# EAGLE design feu_85 (EAGLE 6.3)
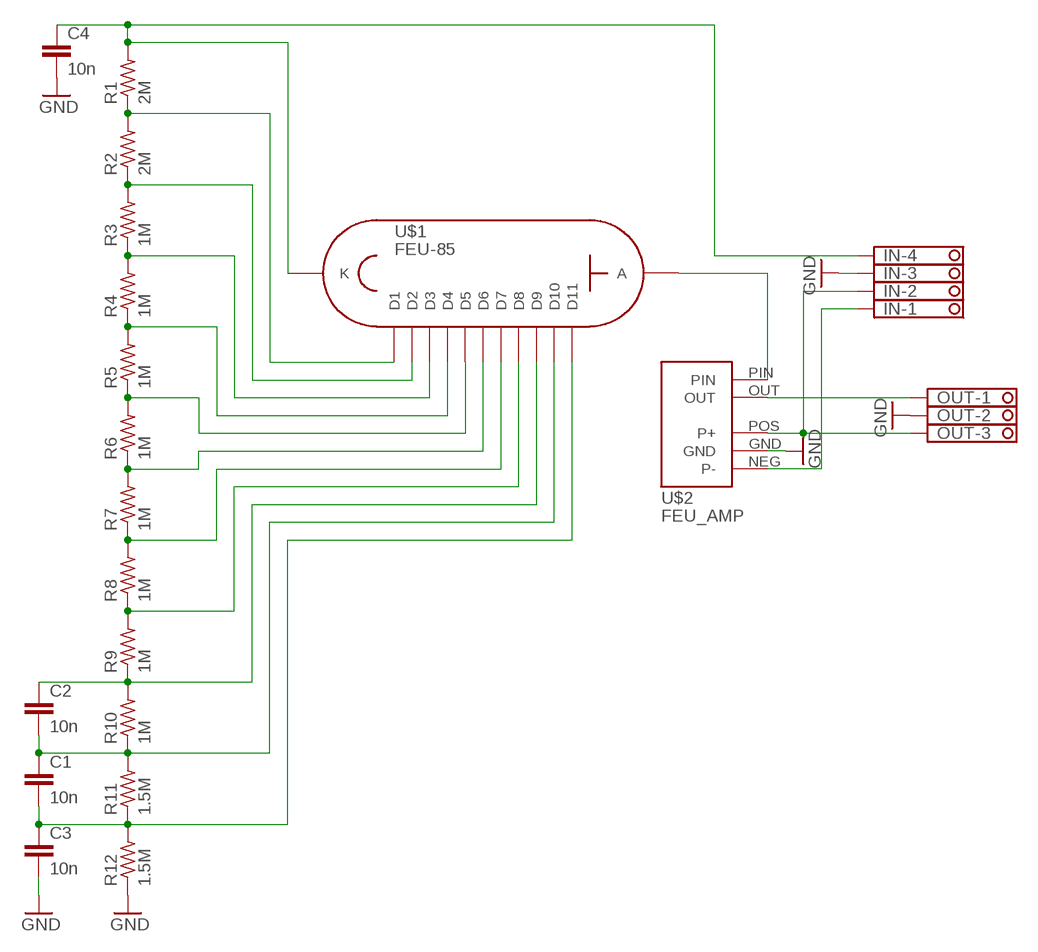
[diagram p0: schematic, sheet 1]

## Parts
C1  10n  C-EU075-032X103  [C075-032X103]
C2  10n  C-EU075-032X103  [C075-032X103]
C3  10n  C-EU075-032X103  [C075-032X103]
C4  10n  C-EU225-087X268  [C225-087X268]
IN  1751264  [1751264]
OUT  1751251  [1751251]
R1  2M  R-US_0207/2V  [0207/2V]
R2  2M  R-US_0207/2V  [0207/2V]
R3  1M  R-US_0207/2V  [0207/2V]
R4  1M  R-US_0207/2V  [0207/2V]
R5  1M  R-US_0207/2V  [0207/2V]
R6  1M  R-US_0207/2V  [0207/2V]
R7  1M  R-US_0207/2V  [0207/2V]
R8  1M  R-US_0207/2V  [0207/2V]
R9  1M  R-US_0207/2V  [0207/2V]
R10  1M  R-US_0207/2V  [0207/2V]
R11  1.5M  R-US_0207/2V  [0207/2V]
R12  1.5M  R-US_0207/2V  [0207/2V]
U$1  FEU-85  [PANEL_14]
U$2  FEU_AMP  [FEU_AMP]

## Nets
GND: C3.2 C4.2 IN.3 OUT.2 R12.1 U$2.GND
N$1: R1.1 R2.2 U$1.P$13(D1)
N$2: R3.1 R4.2 U$1.P$12(D3)
N$3: R4.1 R5.2 U$1.P$3(D4)
N$4: R5.1 R6.2 U$1.P$11(D5)
N$5: R6.1 R7.2 U$1.P$4(D6)
N$6: R7.1 R8.2 U$1.P$10(D7)
N$7: R8.1 R9.2 U$1.P$5(D8)
N$8: C2.1 R9.1 R10.2 U$1.P$9(D9)
N$9: OUT.1 U$2.OUT
N$10: IN.2 OUT.3 U$2.POS(P+)
N$11: R2.1 R3.2 U$1.P$2(D2)
N$12: C4.1 IN.4 R1.2 U$1.P$14(K)
N$13: C1.2 C3.1 R11.1 R12.2 U$1.P$8(D11)
N$14: C1.1 C2.2 R10.1 R11.2 U$1.P$6(D10)
N$15: U$1.P$7(A) U$2.PIN
N$16: IN.1 U$2.NEG(P-)

## Library data of the parts
C1-C4 = resistor:C-EU: CAPACITOR, European symbol
IN = con-phoenix-350:1751264: MKDS 1/ 4-3,5 Printklemme Nennstrom: 10 A Bemessungsspannung: 160 V Raster: 3,5 mm Polzahl: 4 Montageart: Löten Anschlussart: Schraubanschluss Anschlussrichtung vom Leiter zur Platine: 0° Source: http://eshop.phoenixcontact.com .. 1751264.pdf; MPN: 1751264; OC_FARNELL: unknown; OC_NEWARK: 10R0934
OUT = con-phoenix-350:1751251: MKDS 1/ 3-3,5 Printklemme Nennstrom: 10 A Bemessungsspannung: 160 V Raster: 3,5 mm Polzahl: 3 Montageart: Löten Anschlussart: Schraubanschluss Anschlussrichtung vom Leiter zur Platine: 0° Source: http://eshop.phoenixcontact.com .. 1751251.pdf; OC_FARNELL: unknown; OC_NEWARK: unknown
R1-R12 = resistor:R-US_: RESISTOR, American symbol
U$1 = pmt:FEU-85: FEU-85
U$2 = pwr:FEU_AMP: FEU amplifier

## Board
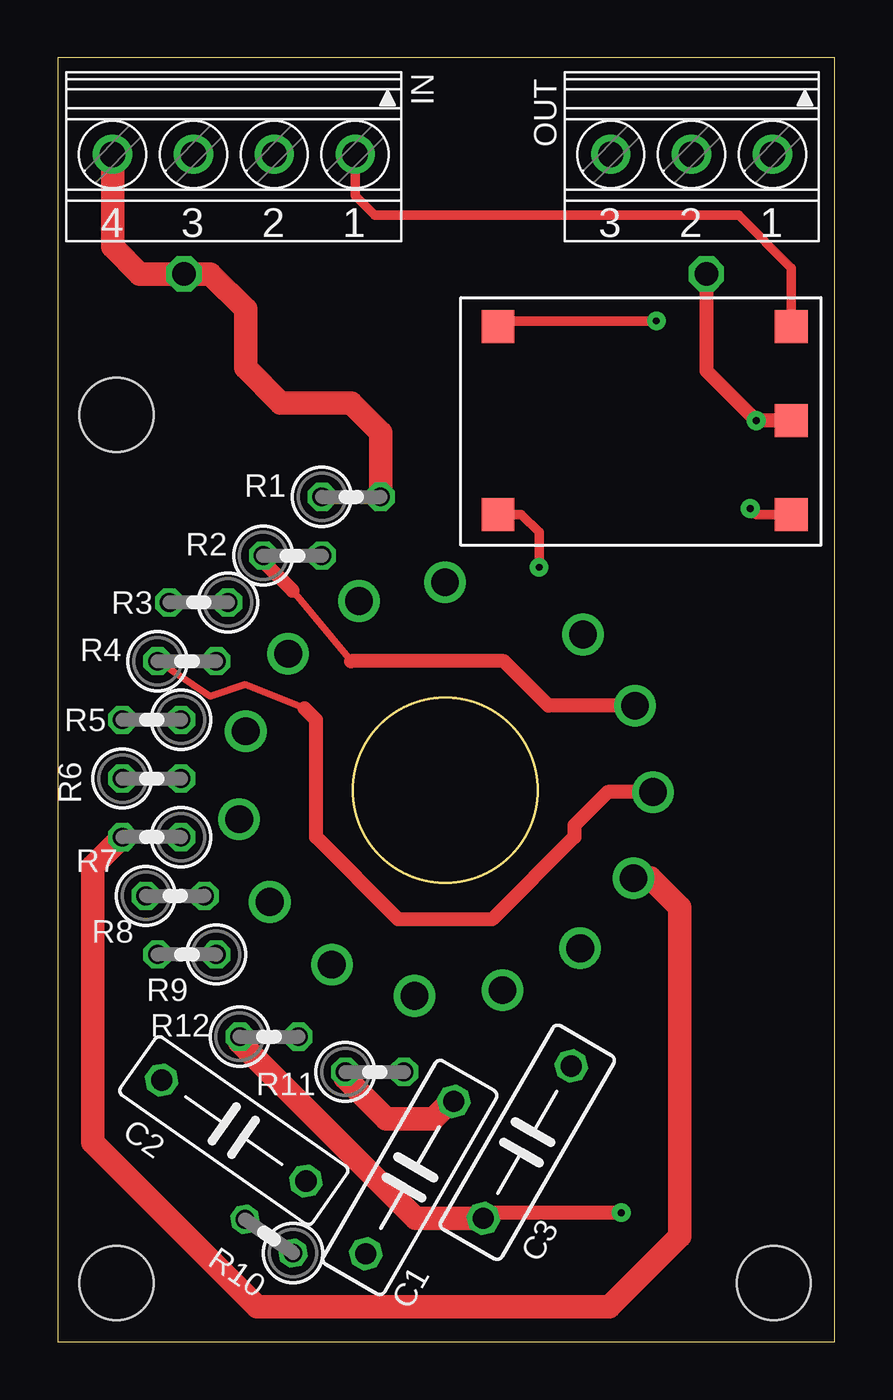
[diagram p1: board, top side]
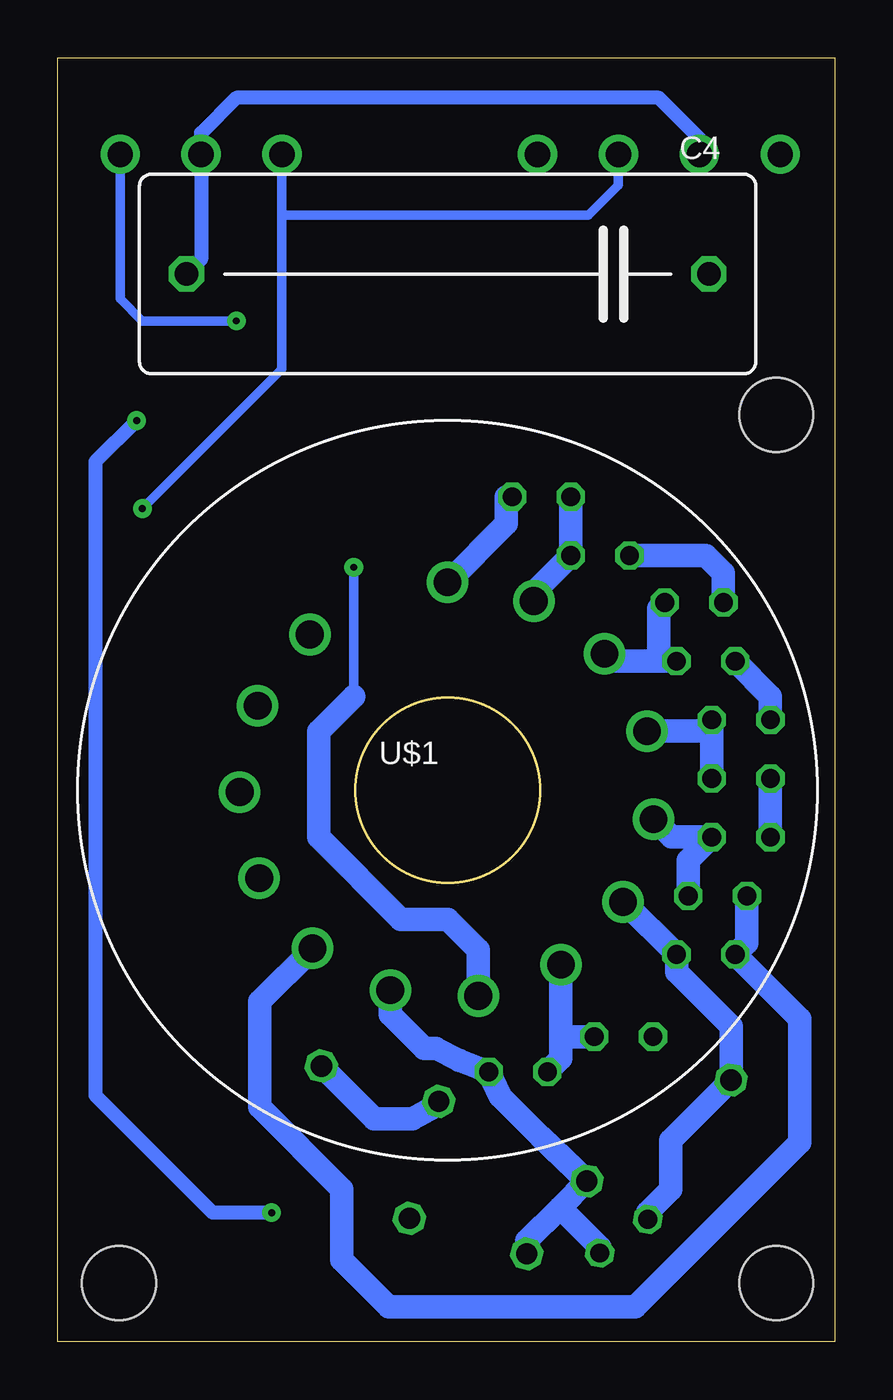
[diagram p2: board, bottom side, seen from below]

Size 33.64 x 55.59 mm. Coordinates in mm from the lower left corner, seen from the top.
Outline: 0,0 33.64,0 33.64,55.59 0,55.59 0,0
Outline: circle at 16.76,23.88 radius 4
Copper layers (1*16): Top 0.035mm / dielectric 1.5mm / Bottom 0.035mm
Design rules "PCBCart-proto": minimum track width 5mil, minimum drill 0.2mm, track to track 6mil, track to pad 6mil, pad to pad 6mil, via to via 6mil, smd to smd 5mil, copper to edge 20mil, drill to drill 8mil, minimum pad ring 8mil, minimum via ring 10mil, stop-mask expansion 3mil, vias tented up to drill 0mil, thermal gap 8mil
Holes 3.2 mm at 2.54,2.54 30.99,2.54 2.54,40.13

### Footprints (pad centres in the part's own frame; a part is rotated, then mirrored left to right if it is on the bottom)
C075-032X103 = drill 0.914 octagon: 1 -3.81,0; 2 3.81,0
C225-087X268 = drill 1.016 octagon: 1 -11.303,0; 2 11.303,0
1751264 = drill 1.1 pad 1.7: 1 -5.25,-0.1; 2 -1.75,-0.1; 3 1.75,-0.1; 4 5.25,-0.1
1751251 = drill 1.1 pad 1.7: 1 -3.5,-0.1; 2 0,-0.1; 3 3.5,-0.1
0207/2V = drill 0.813 octagon: 1 -1.27,0; 2 1.27,0
PANEL_14 = drill 1.2: P$1 -5.964,6.74; P$2 -8.222,3.66; P$3 -9,-0.079; P$4 -8.157,-3.804; P$5 -5.845,-6.844; P$6 -2.48,-8.651; P$7 1.33,-8.901; P$8 4.902,-7.548; P$9 7.59,-4.836; P$10 8.912,-1.253; P$11 8.629,2.556; P$12 6.792,5.905; P$13 3.732,8.19; P$14 0,9
FEU_AMP = smd 1.422 x 1.422: GND -6.35,0.254; NEG -6.35,-3.81; OUT 6.35,-3.81; PIN 6.35,4.318; POS -6.35,4.318

### Placement (x,y rotation side)
C1  15.24,7.11 60 top
C2  7.62,9.14 325 top
C3  20.32,8.64 240 top
C4  16.76,46.23 180 bottom
IN  7.62,51.31 180 top
OUT  27.43,51.31 180 top
R1  12.7,36.58 0 top
R2  10.16,34.04 0 top
R3  6.1,32 180 top
R4  5.59,29.46 0 top
R5  4.06,26.92 180 top
R6  4.06,24.38 0 top
R7  4.06,21.84 180 top
R8  5.08,19.3 0 top
R9  5.59,16.76 180 top
R10  9.14,4.57 145 top
R11  13.72,11.68 0 top
R12  9.14,13.21 0 top
U$1  16.76,23.88 0 bottom
U$2  25.4,40.13 180 top

### Tracks (layer width: path | path; a pad name or v marks a point on that pad's centre or on a via)
GND  (via drill 0.3)
  Top 0.61: C4.2 28.07,42.04 v30.23,39.88 U$2.GND | v24.38,5.59 18.67,5.59 C3.2
  Top 1.016: C3.2 15.49,5.34 7.87,12.95 R12.1
  Bottom 0.61: C4.2 27.43,46.86 OUT.2 27.43,52.32 25.91,53.85 7.62,53.85 5.87,52.1 IN.3 | v30.23,39.88 32,38.1 32,10.67 26.92,5.59 v24.38,5.59
N$1
  Bottom 1.016: R1.1 R2.2 13.03,32.43 U$1.P$13
N$2
  Bottom 1.016: U$1.P$12 9.65,29.46 7.62,29.46 | 7.62,29.46 R4.2 | R3.1 7.62,31.75 7.62,29.46
N$3
  Top 0.305: 10.67,27.43 8.13,28.45 6.6,27.94 R4.1
  Top 0.61: U$1.P$3 23.8,23.8 22.35,22.35 22.35,21.84 18.8,18.29 14.73,18.29 11.18,21.84 11.18,26.92 10.67,27.43
  Bottom 1.016: R5.2 2.79,27.94 R4.1
N$4
  Bottom 1.016: R6.2 R5.1 5.35,26.43 U$1.P$11
N$5
  Top 1.016: U$1.P$4 25.65,20.07 26.92,18.8 26.92,4.57 23.88,1.52 8.64,1.52 1.52,8.64 1.52,20.57 R7.2
  Bottom 1.016: R7.2 R6.1
N$6
  Bottom 1.016: R8.2 6.35,20.83 R7.1 7.07,21.84 U$1.P$10
N$7
  Bottom 1.016: U$1.P$5 22.61,17.02 24.89,14.73 24.89,10.16 21.34,6.6 21.34,3.56 19.3,1.52 8.64,1.52 1.52,8.64 1.52,13.97 R9.2 3.81,17.27 R8.1
N$8
  Bottom 1.016: R10.2 8.1,5.61 7.11,6.6 7.11,8.72 C2.1 4.5,13.64 6.86,16 R9.1 9.13,19.04 U$1.P$9
N$9  (via drill 0.3)
  Top 0.406: v25.91,44.2 19.3,44.2 U$2.OUT
  Bottom 0.406: v25.91,44.2 29.97,44.2 30.93,45.16 OUT.1
N$10  (via drill 0.3)
  Top 0.406: U$2.POS 30.23,35.81 v29.97,36.07
  Bottom 0.406: OUT.3 23.93,48.77 | 23.93,48.77 23.93,42.11 v29.97,36.07 | IN.2 9.37,50.07 10.67,48.77 23.93,48.77
N$11
  Top 0.305: 12.7,29.46 10.16,32.51
  Top 0.61: 12.7,29.46 19.3,29.46 21.23,27.54 U$1.P$2 | R2.1 8.89,33.78 10.16,32.51
  Bottom 1.016: R3.2 4.83,33.27 5.59,34.04 R2.1
N$12
  Top 1.016: R1.2 13.97,39.37 12.7,40.64 9.65,40.64 8.13,42.16 8.13,44.7 6.6,46.23 C4.1 3.56,46.23 2.37,47.41 IN.4
  Bottom 1.016: U$1.P$14 14.22,35.42 14.22,36.58 R1.2
N$13
  Top 1.016: C1.2 17.02,10.41 16.26,9.65 14.22,9.65 12.45,11.43 R11.1
  Bottom 1.016: C1.2 17.14,10.29 18.29,9.65 19.94,9.65 C3.1 | U$1.P$8 11.86,13.21 | 11.86,13.21 11.86,12.27 R11.1 | R12.2 11.86,13.21
N$14
  Bottom 1.016: C1.1 13.34,4.37 11.9,5.8 | 11.9,5.8 C2.2 12.75,8.89 14.48,10.61 R11.2 16.26,12.19 17.27,12.7 17.78,12.7 19.24,14.16 U$1.P$6 | R10.1 10.18,4.09 11.9,5.8
N$15  (via drill 0.3)
  Top 0.406: U$2.PIN 20.07,35.81 20.83,35.05 v20.83,33.53
  Bottom 0.406: v20.83,33.53 20.83,27.94
  Bottom 1.016: 20.83,27.94 22.35,26.42 22.35,21.84 18.8,18.29 16.76,18.29 15.43,16.96 U$1.P$7
N$16
  Top 0.406: U$2.NEG 31.75,46.48 29.46,48.77 13.72,48.77 12.87,49.61 IN.1